# EAGLE design hackstick-0.2.1 (EAGLE 5.11)
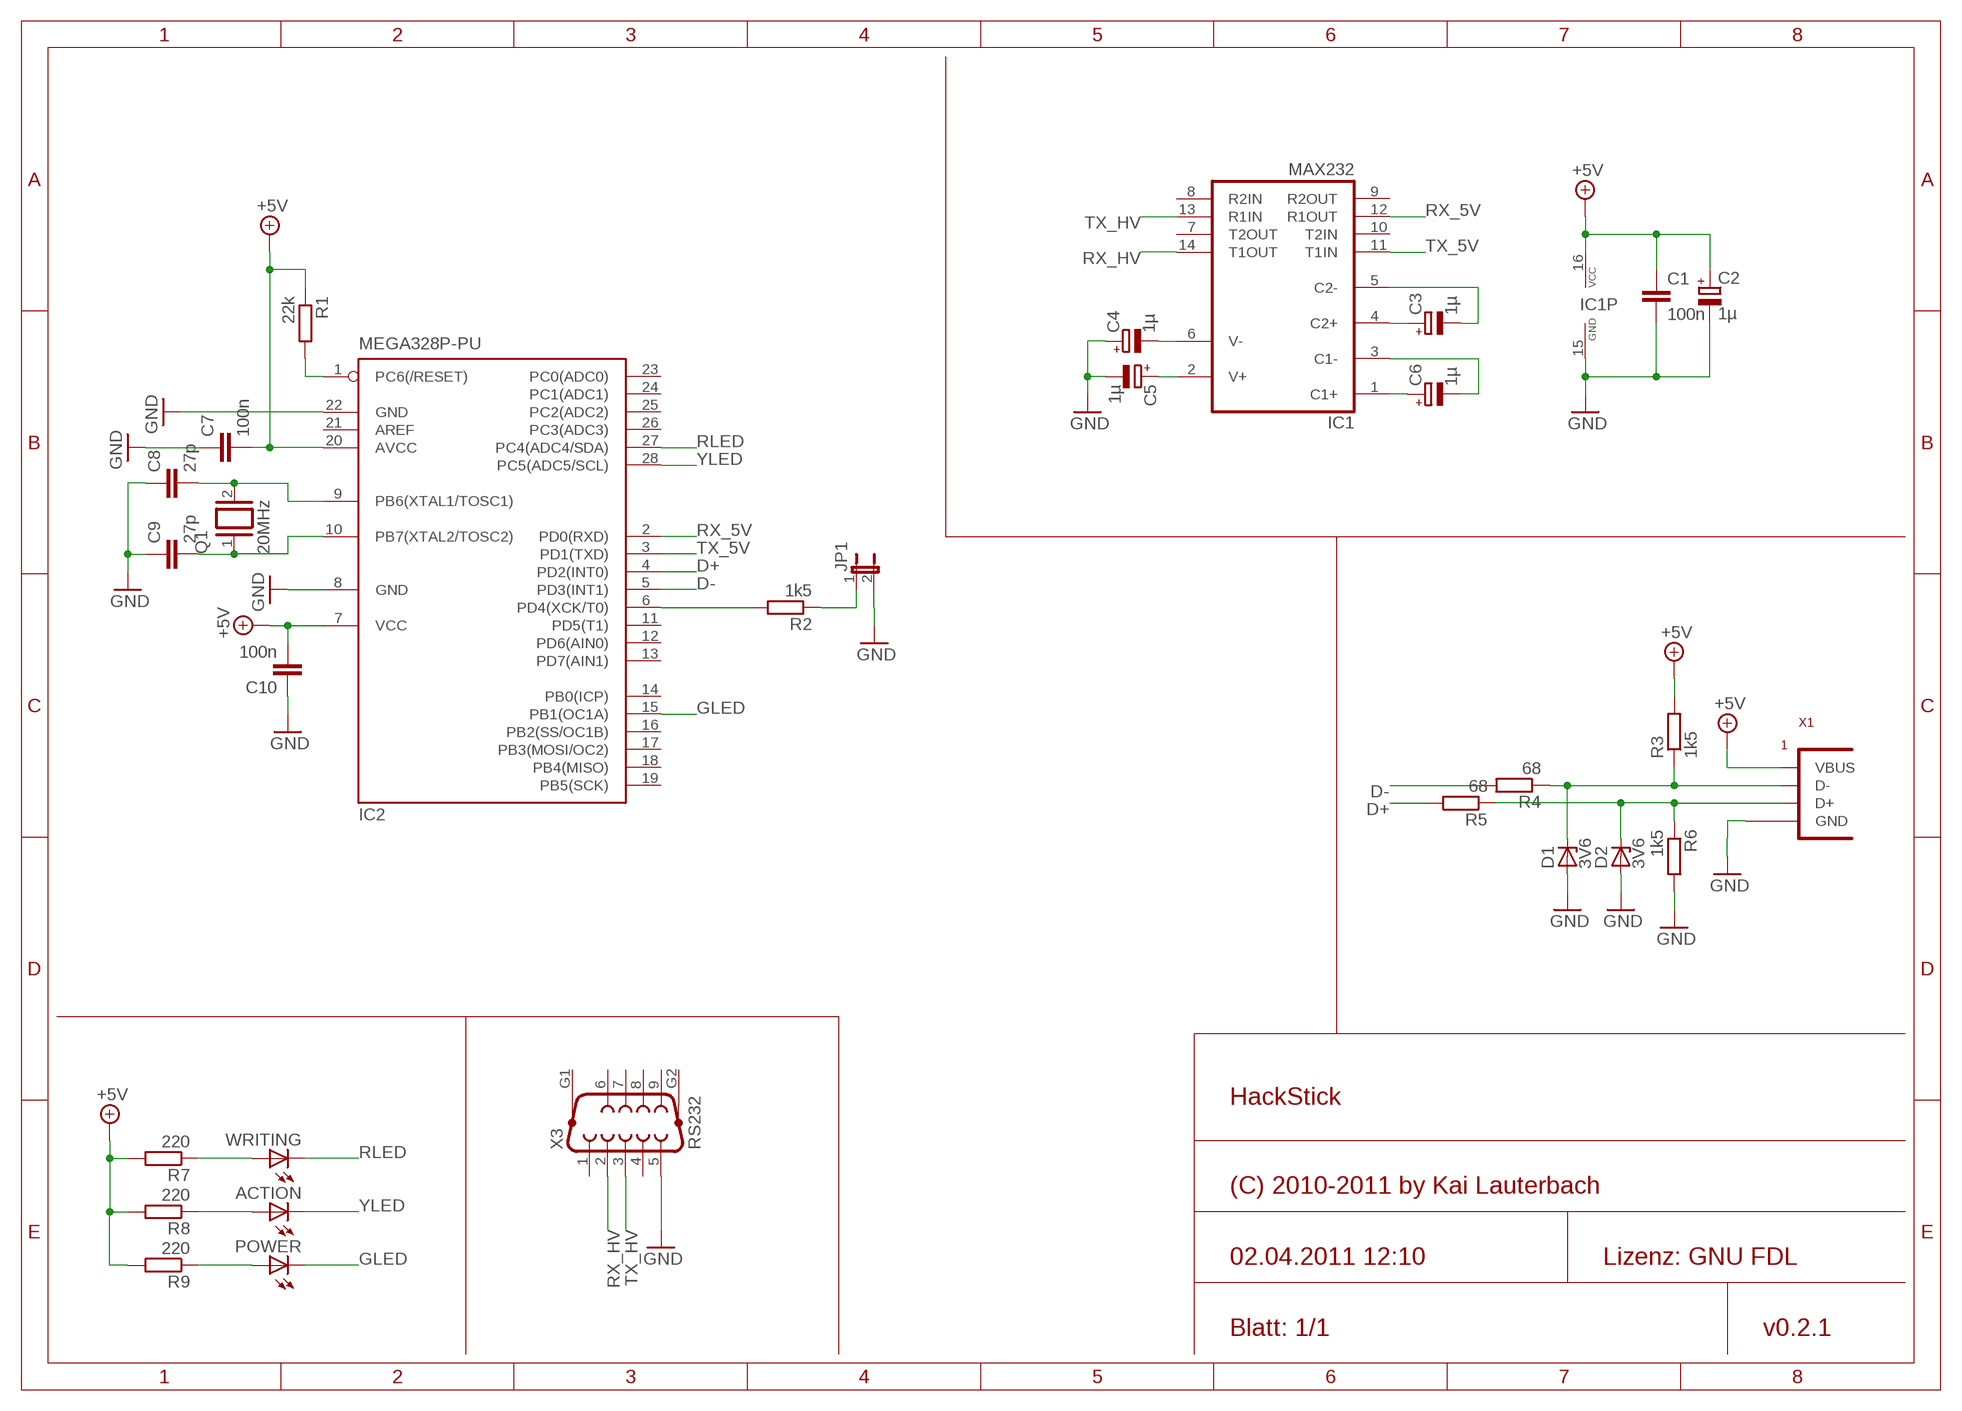
[diagram p0: schematic, sheet 1]

## Parts
ACTION  LED3MM  [LED3MM]
C1  100n  C-EU025-024X044  [C025-024X044]
C2  1µ  CPOL-EUE2-5  [E2-5]
C3  1µ  CPOL-EUE2-5  [E2-5]
C4  1µ  CPOL-EUE2-5  [E2-5]
C5  1µ  CPOL-EUE2-5  [E2-5]
C6  1µ  CPOL-EUE2-5  [E2-5]
C7  100n  C-EU025-025X050  [C025-025X050]
C8  27p  C-EU025-024X044  [C025-024X044]
C9  27p  C-EU025-024X044  [C025-024X044]
C10  100n  C-EU025-025X050  [C025-025X050]
D1  3V6  ZENER-DIODEDO34-7  [DO34Z7]
D2  3V6  ZENER-DIODEDO34-7  [DO34Z7]
IC1  MAX232  [DIL16]
IC2  MEGA328P-PU  MEGA8-P  [DIL28-3]
JP1  JP1E  [JP1]
POWER  LED3MM  [LED3MM]
Q1  20MHz  XTAL/S  [QS]
R1  22k  R-EU_0207/2V  [0207/2V]
R2  1k5  R-EU_0207/2V  [0207/2V]
R3  1k5  R-EU_0207/2V  [0207/2V]
R4  68  R-EU_0207/2V  [0207/2V]
R5  68  R-EU_0207/2V  [0207/2V]
R6  1k5  R-EU_0207/2V  [0207/2V]
R7  220  R-EU_0207/2V  [0207/2V]
R8  220  R-EU_0207/2V  [0207/2V]
R9  220  R-EU_0207/2V  [0207/2V]
WRITING  LED3MM  [LED3MM]
X1  USB_AWFDIP  [USB_AWF]
X3  RS232  F09HP  [F09HP]

## Nets
+5V: C1.1 C2.+ C7.2 C10.2 IC1.16(VCC) IC2.7(VCC) IC2.20(AVCC) R1.1 R3.2 R7.2 R8.2 R9.2 X1.1(VBUS)
D+: IC2.4(PD2(INT0)) R5.2
D-: IC2.5(PD3(INT1)) R4.2
GLED: IC2.15(PB1(OC1A)) POWER.K(C)
GND: C1.2 C2.- C4.+ C5.- C7.1 C8.1 C9.1 C10.1 D1.A D2.A IC1.15(GND) IC2.8(GND) IC2.22(GND) JP1.2 R6.2 X1.S1@1(GND) X3.5
N$1: C8.2 IC2.9(PB6(XTAL1/TOSC1)) Q1.2
N$2: C9.2 IC2.10(PB7(XTAL2/TOSC2)) Q1.1
N$3: C3.+ IC1.4(C2+)
N$4: C3.- IC1.5(C2-)
N$5: D2.C R5.1 R6.1 X1.3(D+)
N$6: D1.C R3.1 R4.1 X1.2(D-)
N$7: C6.- IC1.3(C1-)
N$8: C6.+ IC1.1(C1+)
N$9: C4.- IC1.6(V-)
N$10: C5.+ IC1.2(V+)
N$11: IC2.6(PD4(XCK/T0)) R2.2
N$21: POWER.A R9.1
N$22: R7.1 WRITING.A
N$23: ACTION.A R8.1
N$31: JP1.1 R2.1
RESET: IC2.1(PC6(/RESET)) R1.2
RLED: IC2.27(PC4(ADC4/SDA)) WRITING.K(C)
RX_5V: IC1.12(R1OUT) IC2.2(PD0(RXD))
RX_HV: IC1.14(T1OUT) X3.2
TX_5V: IC1.11(T1IN) IC2.3(PD1(TXD))
TX_HV: IC1.13(R1IN) X3.3
YLED: ACTION.K(C) IC2.28(PC5(ADC5/SCL))
Unconnected: IC1.7(T2OUT) IC1.8(R2IN) IC1.9(R2OUT) IC1.10(T2IN) IC2.11(PD5(T1)) IC2.12(PD6(AIN0)) IC2.13(PD7(AIN1)) IC2.14(PB0(ICP)) IC2.16(PB2(SS/OC1B)) IC2.17(PB3(MOSI/OC2)) IC2.18(PB4(MISO)) IC2.19(PB5(SCK)) IC2.21(AREF) IC2.23(PC0(ADC0)) IC2.24(PC1(ADC1)) IC2.25(PC2(ADC2)) IC2.26(PC3(ADC3)) X3.1 X3.4 X3.6 X3.7 X3.8 X3.9 X3.G1 X3.G2

## Notes on the sheet
- HackStick
- (C) 2010-2011 by Kai Lauterbach
- 02.04.2011 12:10 | Lizenz: GNU FDL
- Blatt: 1/1 | v0.2.1

## Power pins joined to a net without a drawn wire
GND: X1.4(GND) X1.S1(GND)

## Library data of the parts
ACTION POWER WRITING = led:LED: LED OSRAM: - CHIPLED LG R971, LG N971, LY N971, LG Q971, LY Q971, LO R971, LY R971 LH N974, LH R974 LS Q976, LO Q976, LY Q976 LO Q996 - Hyper CHIPLED LW Q18S LB Q993, LB Q99A, LB R99A - SideLED LS A670, LO A670, LY A670, LG A670, LP A670 LB A673, LV A673, LT A673, LW A673 LH A674 LY A675 LS A676, LA A676, LO A676, LY A676, LW A676 LS A679, LY A679, LG A679 - Hyper Micro SIDELED® LS Y876, LA Y876, LO Y876, LY Y876 LT Y87S - SmartLED LW L88C, LW L88S LB L89C, LB L89S, LG L890 LS L89K, LO L89K, LY L89K LS L896, LA L896, LO L896, LY L896 - TOPLED LS T670, LO T670, LY T670, LG T670, LP T670 LSG T670, LSP T670, LSY T670, LOP T670, LYG T670 LG T671, LOG T671, LSG T671 LB T673, LV T673, LT T673, LW T673 LH T674 LS T676, LA T676, LO T676, LY T676, LB T676, LH T676, LSB T676, LW T676 LB T67C, LV T67C, LT T67C, LS T67K, LO T67K, LY T67K, LW E67C LS E67B, LA E67B, LO E67B, LY E67B, LB E67C, LV E67C, LT E67C LW T67C LS T679, LY T679, LG T679 LS T770, LO T770, LY T770, LG T770, LP T770 LB T773, LV T773, LT T773, LW T773 LH T774 LS E675, LA E675, LY E675, LS T675 LS T776, LA T776, LO T776, LY T776, LB T776 LHGB T686 LT T68C, LB T68C - Hyper Mini TOPLED® LB M676 - Mini TOPLED Santana® LG M470 LS M47K, LO M47K, LY M47K Source: http://www.osram.convergy.de LUXEON: - LUMILED® LXK2-PW12-R00, LXK2-PW12-S00, LXK2-PW14-U00, LXK2-PW14-V00 LXK2-PM12-R00, LXK2-PM12-S00, LXK2-PM14-U00 LXK2-PE12-Q00, LXK2-PE12-R00, LXK2-PE12-S00, LXK2-PE14-T00, LXK2-PE14-U00 LXK2-PB12-K00, LXK2-PB12-L00, LXK2-PB12-M00, LXK2-PB14-N00, LXK2-PB14-P00, LXK2-PB14-Q00 LXK2-PR12-L00, LXK2-PR12-M00, LXK2-PR14-Q00, LXK2-PR14-R00 LXK2-PD12-Q00, LXK2-PD12-R00, LXK2-PD12-S00 LXK2-PH12-R00, LXK2-PH12-S00 LXK2-PL12-P00, LXK2-PL12-Q00, LXK2-PL12-R00 Source: www.luxeon.com KINGBRIGHT: KA-3528ASYC Source: www.kingbright.com
C1 C7-C10 = rcl:C-EU: CAPACITOR, European symbol
C2-C6 = rcl:CPOL-EU: POLARIZED CAPACITOR, European symbol
D1 D2 = diode:ZENER-DIODE: Z-Diode
IC1 = maxim:MAX232: RS232 TRANSEIVER
IC2 = atmel:MEGA8-P: MICROCONTROLLER 8 Kbytes FLASH, 1 kbytes SRAM, 512 bytes EEPROM, USART, 4-channel 10 bit ADC, 2-channel 8 bit ADC Pin compatible with Atmega48, ATMega88, ATMega168 Source: avr.lbr
JP1 = jumper:JP1E: JUMPER
Q1 = special:XTAL/S: CRYSTAL
R1-R9 = rcl:R-EU_: RESISTOR, European symbol
X1 = reichelt_usb:USB_AWF
X3 = con-subd:F09HP: SUB-D

## Board
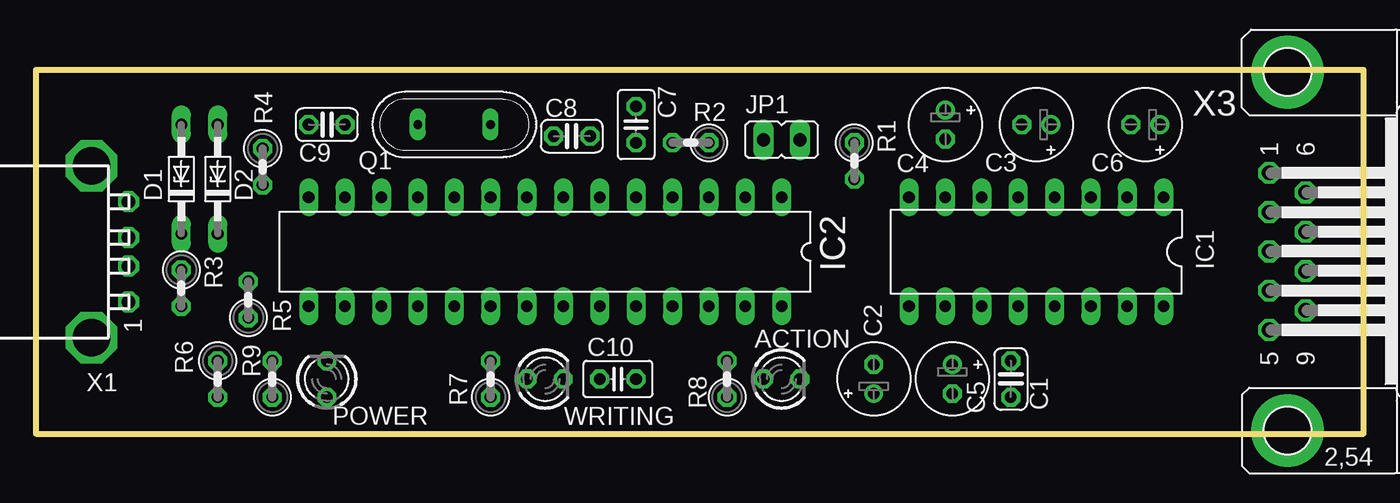
[diagram p1: board, top side]
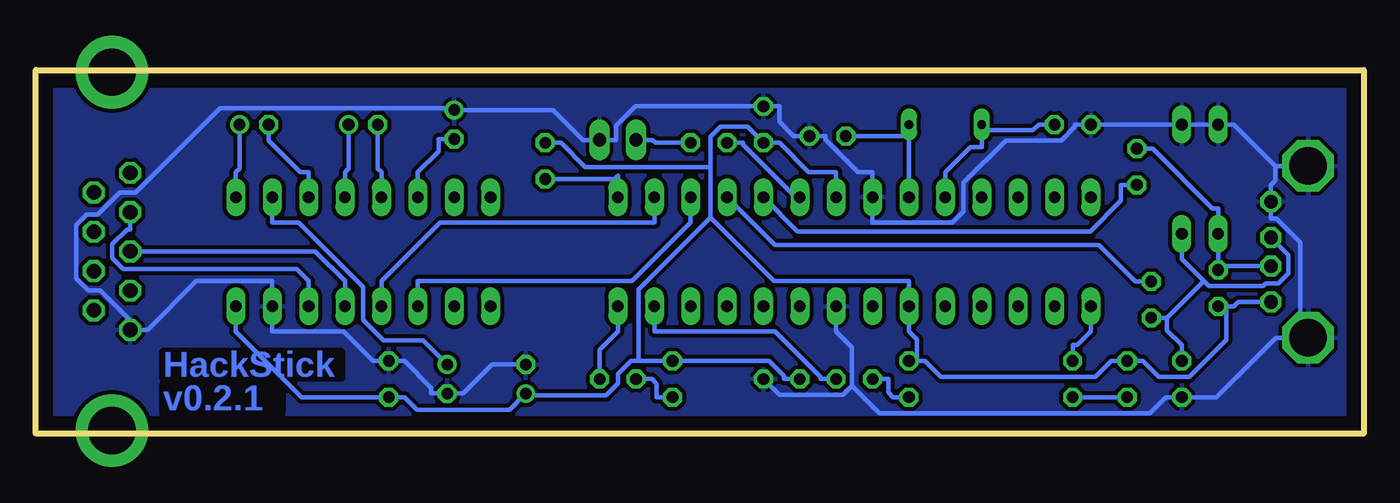
[diagram p2: board, bottom side, seen from below]

Size 92.71 x 25.4 mm. Coordinates in mm from the lower left corner, seen from the top.
Outline: 0,25.4 0,0 92.71,0 92.71,25.4 0,25.4
Copper layers (1*16): Top 0.035mm / dielectric 1.5mm / Bottom 0.035mm
Design rules "default *": minimum track width 13mil, minimum drill 24mil, track to track 11mil, track to pad 11mil, pad to pad 10mil, via to via 8mil, smd to smd 8mil, copper to edge 40mil, drill to drill 8mil, minimum pad ring 10mil, minimum via ring 8mil, stop-mask expansion 4mil, vias tented up to drill 0mil, thermal gap 10mil

### Footprints (pad centres in the part's own frame; a part is rotated, then mirrored left to right if it is on the bottom)
LED3MM = drill 0.813 octagon: A -1.27,0; K 1.27,0
C025-024X044 = drill 0.813 octagon: 1 -1.27,0; 2 1.27,0
E2-5 = drill 0.813 pad 1.27 round: + -1.016,0 | drill 0.813 pad 1.27 octagon: - 1.016,0
C025-025X050 = drill 0.813 octagon: 1 -1.27,0; 2 1.27,0
DO34Z7 = drill 0.813 long: A 3.81,0; C -3.81,0
DIL16 = drill 0.813 long: 1 -8.89,-3.81; 2 -6.35,-3.81; 3 -3.81,-3.81; 4 -1.27,-3.81; 5 1.27,-3.81; 6 3.81,-3.81; 7 6.35,-3.81; 8 8.89,-3.81; 9 8.89,3.81; 10 6.35,3.81; 11 3.81,3.81; 12 1.27,3.81; 13 -1.27,3.81; 14 -3.81,3.81; 15 -6.35,3.81; 16 -8.89,3.81
DIL28-3 = drill 0.813 long: 1 -16.51,-3.81; 2 -13.97,-3.81; 3 -11.43,-3.81; 4 -8.89,-3.81; 5 -6.35,-3.81; 6 -3.81,-3.81; 7 -1.27,-3.81; 8 1.27,-3.81; 9 3.81,-3.81; 10 6.35,-3.81; 11 8.89,-3.81; 12 11.43,-3.81; 13 13.97,-3.81; 14 16.51,-3.81; 15 16.51,3.81; 16 13.97,3.81; 17 11.43,3.81; 18 8.89,3.81; 19 6.35,3.81; 20 3.81,3.81; 21 1.27,3.81; 22 -1.27,3.81; 23 -3.81,3.81; 24 -6.35,3.81; 25 -8.89,3.81; 26 -11.43,3.81; 27 -13.97,3.81; 28 -16.51,3.81
JP1 = drill 0.914 long: 1 0,-1.27; 2 0,1.27
QS = drill 0.61 long: 1 -2.54,0; 2 2.54,0
0207/2V = drill 0.813 octagon: 1 -1.27,0; 2 1.27,0
USB_AWF = drill 0.95 octagon: 1 3.5,1.4; 2 1,1.4; 3 -1,1.4; 4 -3.5,1.4 | drill 2.6 pad 3.2 octagon: S1 6,-1.2; S1@1 -6,-1.2
F09HP = drill 1.016 octagon: 1 -5.486,-1.27; 2 -2.743,-1.27; 3 0,-1.27; 4 2.743,-1.27; 5 5.486,-1.27; 6 -4.115,1.27; 7 -1.372,1.27; 8 1.372,1.27; 9 4.115,1.27 | drill 3.302 pad 5.08 round: G1 -12.522,0; G2 12.522,0

### Placement (x,y rotation side)
ACTION  52.07,3.81 0 top
C1  68.07,3.81 90 top
C2  58.5,3.81 90 top
C3  69.85,21.59 180 top
C4  63.5,21.59 270 top
C5  63.99,3.81 270 top
C6  77.47,21.59 180 top
C7  41.91,21.59 270 top
C8  37.42,20.78 180 top
C9  20.32,21.59 0 top
C10  40.64,3.81 180 top
D1  10.16,17.78 90 top
D2  12.7,17.78 90 top
IC1  69.85,12.7 180 top
IC2  35.56,12.7 180 top
JP1  52.07,20.52 270 top
POWER  20.32,3.81 90 top
Q1  29.21,21.59 0 top
R1  57.15,19.05 270 top
R2  45.72,20.32 180 top
R3  10.16,10.16 270 top
R4  15.84,18.64 270 top
R5  14.84,9.36 90 top
R6  12.7,3.81 270 top
R7  31.75,3.81 90 top
R8  48.26,3.81 90 top
R9  16.51,3.81 90 top
WRITING  35.56,3.81 0 top
X1  5.08,12.7 270 top
X3  87.39,12.73 270 top

### Tracks (layer width: path | path; a pad name or v marks a point on that pad's centre or on a via)
+5V
  Bottom 0.33: 50.64,5.08 50.64,10.06 45.6,15.1 | 50.64,5.08 R8.2 41.52,5.08 40.47,4.04 40.47,3.81 C10.2 | 50.64,5.08 51.16,5.08 52.07,4.17 52.07,3.52 52.9,2.68 58.39,2.68 C2.+ 59.64,1.66 66.08,1.66 66.97,2.54 C1.1 74.16,2.54 78.74,7.12 IC1.16 | 45.6,18.63 45.6,20.73 44.89,21.45 43.04,21.45 C7.2 40.8,20.32 38.76,18.28 36.83,18.28 IC2.7 | 45.6,15.1 45.6,18.63 | 45.6,18.63 54.36,18.63 56.04,20.32 R1.1 | 45.6,15.1 41.16,10.66 31.75,10.66 IC2.20 31.75,8.52 31.75,7.12 31.2,6.57 31.2,5.08 | 31.2,5.08 30.64,5.08 29.53,3.97 18.73,3.97 17.62,5.08 R9.2 15.4,5.08 14.3,3.98 12.18,3.98 9.61,6.54 9.61,8.89 | 31.2,5.08 R7.2 | 9.61,8.89 9.05,8.89 8.74,9.2 X1.1 | 9.61,8.89 R3.2
D+
  Bottom 0.33: R5.2 15.94,10.63 18.49,13.18 41.12,13.18 IC2.4
D-
  Bottom 0.33: R4.2 16.95,17.37 16.95,16.27 19.08,14.13 39.53,14.13 IC2.5
GLED
  Bottom 0.33: POWER.K 20.32,6.19 19.99,6.19 19.05,7.12 IC2.15
GND
  Bottom 0.33: 85.46,7.24 88.21,9.99 89.04,9.99 89.89,10.84 89.89,14.58 89.16,15.31 88.38,15.31 86.84,16.84 85.73,16.84 79.85,22.73 63.62,22.73 C4.+ 56.58,22.61 54.5,20.52 JP1.2 52.18,20.52 52.18,21.53 50.86,22.86 C7.1 40.8,22.86 40.8,21.79 39.8,20.78 C8.1 37.59,20.78 37.59,20.55 35.31,18.28 34.29,18.28 IC2.8 34.29,16.34 34.29,14.75 28.72,14.75 27.94,15.53 27.94,17.52 24.98,20.48 21.12,20.48 20.16,21.45 20.16,21.59 C9.1 D2.A D1.A 9.05,21.59 6.16,18.7 | 85.46,7.24 84.91,7.24 81.5,10.66 76.2,10.66 IC1.15 76.2,7.12 71.22,7.12 69.17,5.08 C1.2 66.97,5.08 65.09,3.21 65.09,2.79 C5.- 62.88,2.79 60.85,4.83 C2.- | 85.46,7.24 X3.5 | 35.72,3.33 36.36,2.69 40.79,2.69 C10.1 | 35.72,3.33 35.72,6.02 36.83,7.12 IC2.22 | 35.72,3.33 33.82,1.42 14.92,1.42 13.8,2.54 R6.2 10.29,2.54 6.13,6.7 4.44,6.7 | 4.44,6.7 4.44,13.35 6.12,15.03 6.48,15.03 X1.4 6.48,17.37 6.16,17.69 6.16,18.7 | X1.S1 4.44,6.7 | 6.16,18.7 5.01,18.7 X1.S1@1
  pour Bottom: 0,25.4 92.71,25.4 92.71,0 0,0
N$1
  Bottom 0.33: IC2.9 31.75,20.78 | 31.75,20.78 Q1.2 | 31.75,20.78 35.05,20.78 C8.2
N$2
  Bottom 0.33: C9.2 22.7,21.59 23.1,21.19 26.67,21.19 | 26.67,21.19 26.67,20.03 27.46,20.03 29.21,18.28 IC2.10 | 26.67,21.19 Q1.1
N$3
  Bottom 0.33: IC1.4 71.12,18.28 70.87,18.53 C3.+
N$4
  Bottom 0.33: IC1.5 68.58,18.28 68.83,18.53 C3.-
N$5
  Bottom 0.33: 11.16,10.67 12.7,12.21 D2.C | X1.3 5.27,12.49 5.27,11.18 5.96,10.49 6.85,10.49 7.01,10.33 10.82,10.33 11.16,10.67 | 11.16,10.67 13.74,8.09 | 13.74,8.09 13.89,8.09 R5.1 | R6.1 12.7,6.19 13.74,7.22 13.74,8.09
N$6
  Bottom 0.33: R4.1 14.74,19.91 10.56,15.73 10.16,15.73 D1.C 10.16,13.6 10.16,12.21 10.16,11.7 | 10.16,11.7 R3.1 | 10.16,11.7 7.65,11.7 X1.2
N$7
  Bottom 0.33: IC1.3 73.66,18.28 74.24,18.28 76.45,20.48 C6.-
N$8
  Bottom 0.33: IC1.1 78.74,18.28 78.49,18.53 C6.+
N$9
  Bottom 0.33: C4.- 64.61,20.57 64.61,19.71 66.04,18.28 IC1.6
N$10
  Bottom 0.33: IC1.2 76.2,14.75 74.35,14.75 69.85,10.25 69.85,7.94 68.43,6.52 65.68,6.52 C5.+
N$11
  Bottom 0.33: R2.2 43.34,20.32 43.34,20.18 39.67,16.51 IC2.6
N$21
  Bottom 0.33: R9.1 POWER.A
N$22
  Bottom 0.33: WRITING.A 33.18,3.81 33.18,2.87 32.85,2.54 R7.1
N$23
  Bottom 0.33: R8.1 49.36,2.54 49.36,3.48 49.7,3.81 ACTION.A
N$31
  Bottom 0.33: JP1.1 49.64,20.52 49.44,20.32 R2.1
RESET
  Bottom 0.33: IC2.1 52.07,18.02 52.31,17.78 56.04,17.78 R1.2
RLED
  Bottom 0.33: IC2.27 49.53,7.12 41.11,7.12 37.93,3.95 37.93,3.81 WRITING.K
RX_5V
  Bottom 0.33: IC1.12 68.58,10.66 64.49,14.75 49.53,14.75 IC2.2
RX_HV
  Bottom 0.33: IC1.14 73.66,10.66 74.51,11.51 86.62,11.51 87.37,12.26 87.37,13.24 86.35,14.27 86.12,14.27 X3.2
TX_5V
  Bottom 0.33: IC1.11 66.04,10.66 51.08,10.66 46.99,14.75 IC2.3
TX_HV
  Bottom 0.33: IC1.13 71.12,10.66 73.19,12.73 X3.3
YLED
  Bottom 0.33: IC2.28 52.07,7.12 53.34,5.86 ACTION.K

### Text on the board
Bottom: HackStick | v0.2.1